# EAGLE design LED_MATRIX1 (EAGLE 7.2.0)
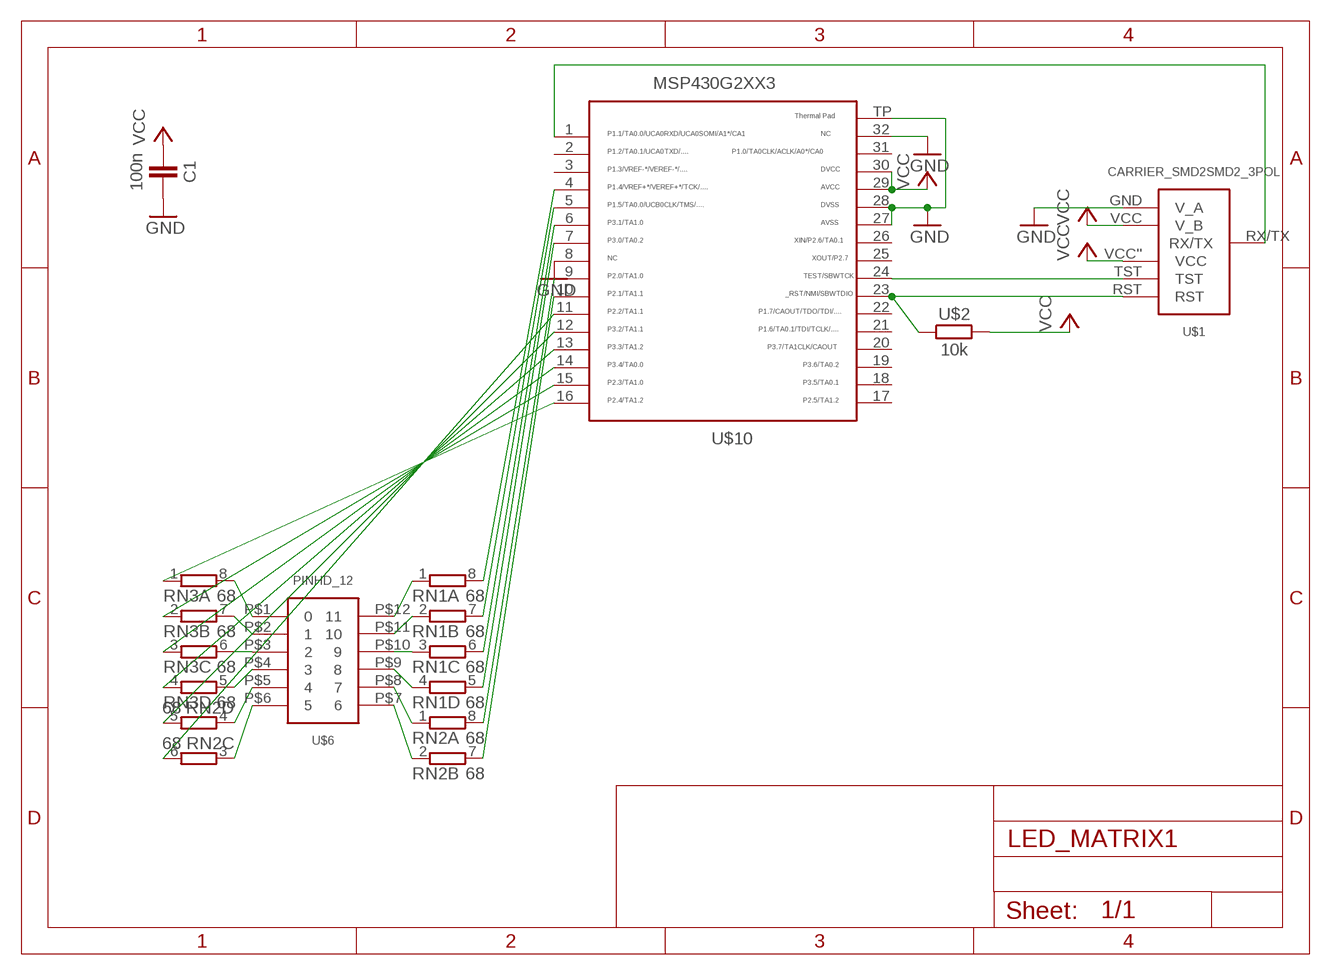
[diagram p0: schematic, sheet 1]

## Parts
C1  100n  CAPACITOR  [603]
RN1  68  4R-N0603-ARC  [0603-ARC]
RN2  68  4R-N0603-ARC  [0603-ARC]
RN3  68  4R-N0603-ARC  [0603-ARC]
U$1  CARRIER_SMD2SMD2_3POL  [CARRIER_SMD2_3POL]
U$2  10k  RESISTOR0603  [603]
U$6  PINHD_12  [FFC12/1MM]
U$10  MSP430G2553  [QFN32]

## Nets
GND: C1.2 U$1.GND(V_A) U$10.8 U$10.27 U$10.28 U$10.32 U$10.TP
N$2: RN3.1 U$10.16
N$3: U$1.TST U$10.24
N$4: U$1.RST U$2.1 U$10.23
N$5: RN3.7 U$6.P$2
N$6: RN3.2 U$10.15
N$7: RN3.3 U$10.14
N$11: RN3.4 U$10.13
N$12: U$1.RX/TX U$10.1
N$13: RN2.5 U$10.12
N$14: RN2.6 U$10.11
N$16: RN2.7 U$10.10
N$17: RN2.8 U$10.9
N$18: RN1.5 U$10.7
N$19: RN1.6 U$10.6
N$20: RN1.7 U$10.5
N$21: RN1.8 U$10.4
N$22: RN1.1 U$6.P$12
N$24: RN1.2 U$6.P$11
N$38: RN1.3 U$6.P$10
N$39: RN1.4 U$6.P$9
N$40: RN2.1 U$6.P$8
N$41: RN2.2 U$6.P$7
N$42: RN2.3 U$6.P$6
N$43: RN2.4 U$6.P$5
N$44: RN3.5 U$6.P$4
N$45: RN3.6 U$6.P$3
N$47: RN3.8 U$6.P$1
VCC: C1.1 U$1.VCC''(VCC) U$1.VCC(V_B) U$2.2 U$10.29 U$10.30
Unconnected: U$10.2 U$10.3 U$10.17 U$10.18 U$10.19 U$10.20 U$10.21 U$10.22 U$10.25 U$10.26 U$10.31

## Library data of the parts
C1 = thar:CAPACITOR
RN1-RN3 = resistor-dil:4R-N: Array Chip Resistor Source: RS Component / Phycomp; OC_FARNELL: unknown; OC_NEWARK: unknown
U$1 = thar:CARRIER_SMD2
U$2 = thar:RESISTOR
U$6 = thar:PINHD_12
U$10 = thar:MSP430G2553: TEXAS INSTRUMENTS MSP430G2553IRHB32R MCU, 16BIT, MSP430, 16MHZ, QFN-32 Farnell Best.Nr.: 2325726 Herst.Bez.: MSP430G2553IRHB32R

## Board
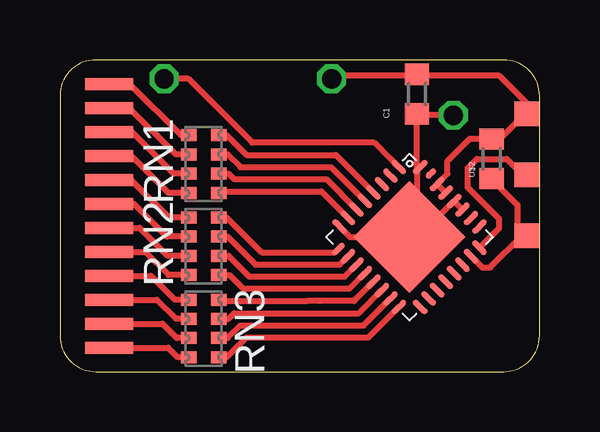
[diagram p1: board, top side]
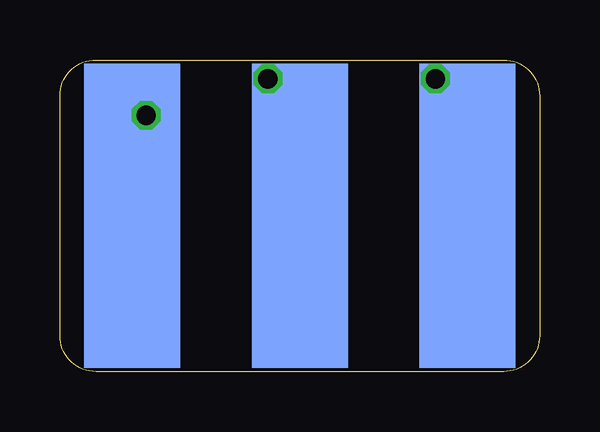
[diagram p2: board, bottom side, seen from below]

Size 20 x 13 mm. Coordinates in mm from the lower left corner, seen from the top.
Copper layers (1*16): Top 0.035mm / dielectric 1.5mm / Bottom 0.035mm
Design rules "Bilex DRU *": minimum track width 10mil, minimum drill 24mil, track to track 10mil, track to pad 10mil, pad to pad 10mil, via to via 10mil, smd to smd 10mil, copper to edge 1mil, drill to drill 8mil, minimum pad ring 10mil, minimum via ring 8mil, stop-mask expansion 4mil, vias tented up to drill 0mil, thermal gap 10mil

### Footprints (pad centres in the part's own frame; a part is rotated, then mirrored left to right if it is on the bottom)
603 = smd 0.889 x 1.016: 1 -0.826,0; 2 0.826,0
0603-ARC = smd 0.5 x 0.65: 1 -1.2,-0.625; 2 -0.4,-0.625; 3 0.4,-0.625; 4 1.2,-0.625; 5 1.2,0.625; 6 0.4,0.625; 7 -0.4,0.625; 8 -1.2,0.625
CARRIER_SMD2_3POL = smd 4 x 12.7 bottom: GND -6.985,0; RX/TX 6.985,0; VCC 0,0 | smd 1.016 x 1.016: RST -9.461,0.826; TST -9.461,-1.714; VCC'' -9.461,-4.255
FFC12/1MM = smd 2 x 0.5: P$1 0,5.5; P$2 0,4.5; P$3 0,3.5; P$4 0,2.5; P$5 0,1.5; P$6 0,0.5; P$7 0,-0.5; P$8 0,-1.5; P$9 0,-2.5; P$10 0,-3.5; P$11 0,-4.5; P$12 0,-5.5
QFN32 = smd 0.762 x 0.254: 1 -2.375,1.75; 2 -2.375,1.25; 3 -2.375,0.75; 4 -2.375,0.25; 5 -2.375,-0.25; 6 -2.375,-0.75; 7 -2.375,-1.25; 8 -2.375,-1.75; 17 2.375,-1.75; 18 2.375,-1.25; 19 2.375,-0.75; 20 2.375,-0.25; 21 2.375,0.25; 22 2.375,0.75; 23 2.375,1.25; 24 2.375,1.75 | smd 0.254 x 0.635: 9 -1.75,-2.438 | smd 0.254 x 0.762: 10 -1.25,-2.375; 11 -0.75,-2.375; 12 -0.25,-2.375; 13 0.25,-2.375; 14 0.75,-2.375; 15 1.25,-2.375; 16 1.75,-2.375; 25 1.75,2.375; 26 1.25,2.375; 27 0.75,2.375; 28 0.25,2.375; 29 -0.25,2.375; 30 -0.75,2.375; 32 -1.75,2.375 | smd 0.254 x 0.508: 31 -1.25,2.5 | smd 3.302 x 3.302: TP 0,0

### Placement (x,y rotation side)
C1  14.89,11.58 270 top
RN1  6,8.66 270 top
RN2  6,5.23 270 top
RN3  6,1.8 90 top
U$1  10,6.5 180 top
U$2  18,8.88 90 top
U$6  2.06,6.5 180 top
U$10  14.58,5.61 315 top

### Tracks (layer width: path | path; a pad name or v marks a point on that pad's centre or on a via)
GND  (via drill 0.8)
  Top 0.254: U$10.27 U$10.28 14.68,5.35 U$10.TP | U$10.TP 14.58,6.32 14.89,7.13 14.89,8.39 U$10.32 14.89,8.4 C1.2 15.02,10.62 | v16.41,10.69 14.96,10.69 | U$10.8 12.1,5.61 U$10.TP
  Top 0.406: 14.96,10.69 14.89,10.69 C1.2
  Bottom 0.254: 18,6.5 16.6,10.5 v16.41,10.69 16.98,10.5 U$1.GND
N$2
  Top 0.254: U$10.16 12.86,1.42 7.78,1.42 6.96,0.6 RN3.1
N$3
  Top 0.254: U$10.24 18.32,5.99 18.32,6.37 17.01,7.68 17.01,8.49 17.39,8.88 18.62,8.88 19.29,8.21 U$1.TST
N$4
  Top 0.254: 19.46,5.48 19.5,5.69 | 19.5,5.69 19.08,5.74 19.08,6.95 18.06,7.97 U$2.1 | U$10.23 17.62,4.34 17.93,4.34 19.27,5.67 U$1.RST 19.48,5.69 19.5,5.69
N$5
  Top 0.254: U$6.P$2 4.27,2 4.87,1.4 RN3.7
N$6
  Top 0.254: U$10.15 12.66,1.92 7.52,1.92 6.99,1.4 RN3.2
N$7
  Top 0.254: U$10.14 12.46,2.43 7.27,2.43 7.03,2.2 RN3.3
N$11
  Top 0.254: U$10.13 12.27,2.94 10.82,2.94 10.31,2.94 6.63,2.94 RN3.4
N$12  (via drill 0.8)
  Top 0.254: U$10.1 13.75,8.91 13.74,8.91 13.11,9.54 8.03,9.54 5.36,12.21 v4.35,12.21
  Bottom 0.254: U$1.RX/TX 3.01,10.88 v4.35,12.21
N$13
  Top 0.254: U$10.12 12.07,3.45 7.65,3.45 7.07,4.03 RN2.5
N$14
  Top 0.254: U$10.11 11.87,3.96 7.9,3.96 7.03,4.83 RN2.6
N$16
  Top 0.254: U$10.10 11.67,4.46 8.16,4.46 6.99,5.63 RN2.7
N$17
  Top 0.254: U$10.9 11.47,4.97 8.41,4.97 6.96,6.43 RN2.8
N$18
  Top 0.254: RN1.5 6.62,7.5 6.63,7.51 10.91,7.51 U$10.7
N$19
  Top 0.254: RN1.6 7.03,8.26 7.27,8.02 11.11,8.02 U$10.6
N$20
  Top 0.254: RN1.7 6.99,9.06 7.52,8.53 11.3,8.53 U$10.5
N$21
  Top 0.254: RN1.8 6.96,9.86 7.78,9.04 11.5,9.04 U$10.4
N$22
  Top 0.254: U$6.P$12 2.91,12 5.05,9.86 RN1.1
N$24
  Top 0.254: U$6.P$11 2.89,11 4.83,9.06 RN1.2
N$38
  Top 0.254: U$6.P$10 3,10 4.75,8.26 RN1.3
N$39
  Top 0.254: U$6.P$9 2.99,9 4.53,7.46 RN1.4
N$40
  Top 0.254: U$6.P$8 2.97,8 4.54,6.43 RN2.1
N$41
  Top 0.254: U$6.P$7 3.08,7 4.45,5.63 RN2.2
N$42
  Top 0.254: U$6.P$6 3.32,6 4.49,4.83 RN2.3
N$43
  Top 0.254: U$6.P$5 3.56,5 4.53,4.03 RN2.4
N$44
  Top 0.254: RN3.5 4.8,3 3.8,4 U$6.P$4
N$45
  Top 0.254: U$6.P$3 4.04,3 4.83,2.2 RN3.6
N$47
  Top 0.254: U$6.P$1 4.51,1 4.91,0.6 RN3.8
VCC  (via drill 0.8)
  Top 0.254: U$10.29 U$10.30 16.16,8.25 16.16,8.78 17.07,9.7 U$2.2 18.12,9.48 19.2,10.56 19.2,10.51 19.46,10.56 | 19.5,10.52 19.46,10.56 | 19.65,10.95 19.65,10.75 19.52,10.62 | 19.52,10.62 19.46,10.56 | 19.52,10.62 19.46,10.69 U$1.VCC'' 19.59,10.88 19.46,11.2 18.32,12.34 14.89,12.34 | 14.89,12.34 11.46,12.34 v11.33,12.21 | C1.1 14.89,12.34
  Bottom 0.254: U$1.VCC 10,10.88 v11.33,12.21